# EAGLE design brick_i2c_LSM303DLH (EAGLE 7.2.0)
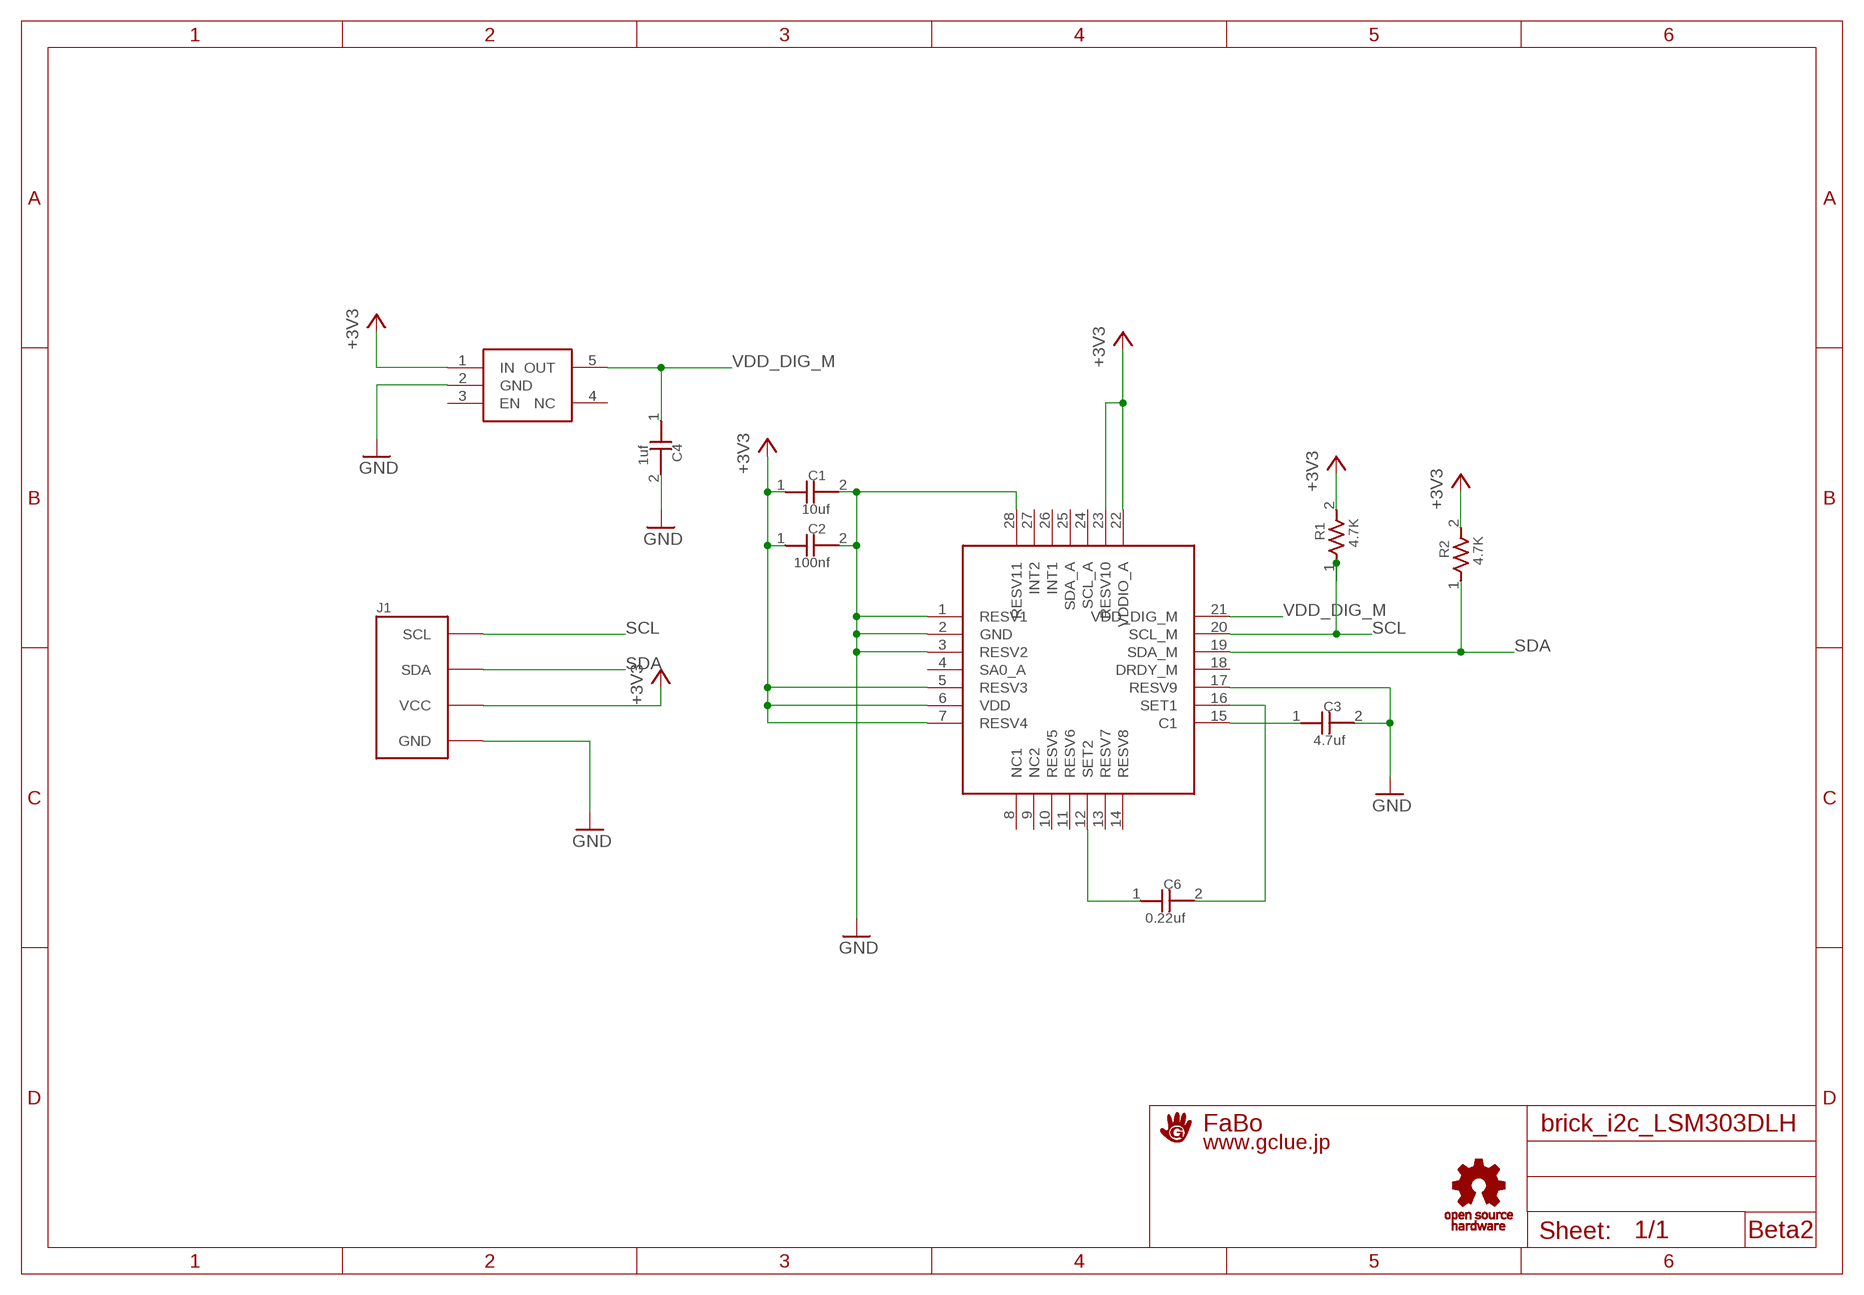
[diagram p0: schematic, sheet 1]

## Parts
C1  10uf  CAPACITOR0603  [0603]
C2  100nf  CAPACITOR0603  [0603]
C3  4.7uf  CAPACITOR0603  [0603]
C4  1uf  CAPACITOR0603  [0603]
C6  0.22uf  CAPACITOR0603  [0603]
J1  BRICK_I2C  [BRICK_I2C]
R1  4.7K  RESISTOR0603  [0603]
R2  4.7K  RESISTOR0603  [0603]
U$1  A4L-LOC-FABO_M  [LOGO_FABO_M]
U$2  ST-LSM303DLH  [LGA-28]
U$3  TI-TLV70018DDCT  [SOT23-5]
U$4  LOGO_OSHW_T-M  [LOGO_OSHW_T_M]

## Nets
+3V3: C1.1 C2.1 J1.VCC R1.2 R2.2 U$2.5(RESV3) U$2.6(VDD) U$2.7(RESV4) U$2.22(VDDIO_A) U$2.23(RESV10) U$3.1(IN)
GND: C1.2 C2.2 C3.2 C4.2 J1.GND U$2.1(RESV1) U$2.2(GND) U$2.3(RESV2) U$2.17(RESV9) U$2.28(RESV11) U$3.2(GND)
N$1: C6.1 U$2.12(SET2)
N$2: C6.2 U$2.16(SET1)
N$3: C3.1 U$2.15(C1)
SCL: J1.SCL R1.1 U$2.20(SCL_M)
SDA: J1.SDA R2.1 U$2.19(SDA_M)
VDD_DIG_M: C4.1 U$2.21(VDD_DIG_M) U$3.5(OUT)
Unconnected: U$2.4(SA0_A) U$2.8(NC1) U$2.9(NC2) U$2.10(RESV5) U$2.11(RESV6) U$2.13(RESV7) U$2.14(RESV8) U$2.18(DRDY_M) U$2.24(SCL_A) U$2.25(SDA_A) U$2.26(INT1) U$2.27(INT2) U$3.3(EN) U$3.4(NC)

## Notes on the sheet
- Beta2

## Library data of the parts
C1-C4 C6 = GClue-Capacitor:CAPACITOR
J1 = gclue:BRICK_I2C: FaBo Brick 4pin(I2C)
R1 R2 = GClue-Resistors:RESISTOR
U$1 = gclue:A4L-LOC: FaBo A4 FRAME
U$2 = GClue-Mems:ST-LSM303DLH
U$3 = gclueParts:TI-TLV70018DDCT
U$4 = gclue:LOGO_OSHW_T

## Board
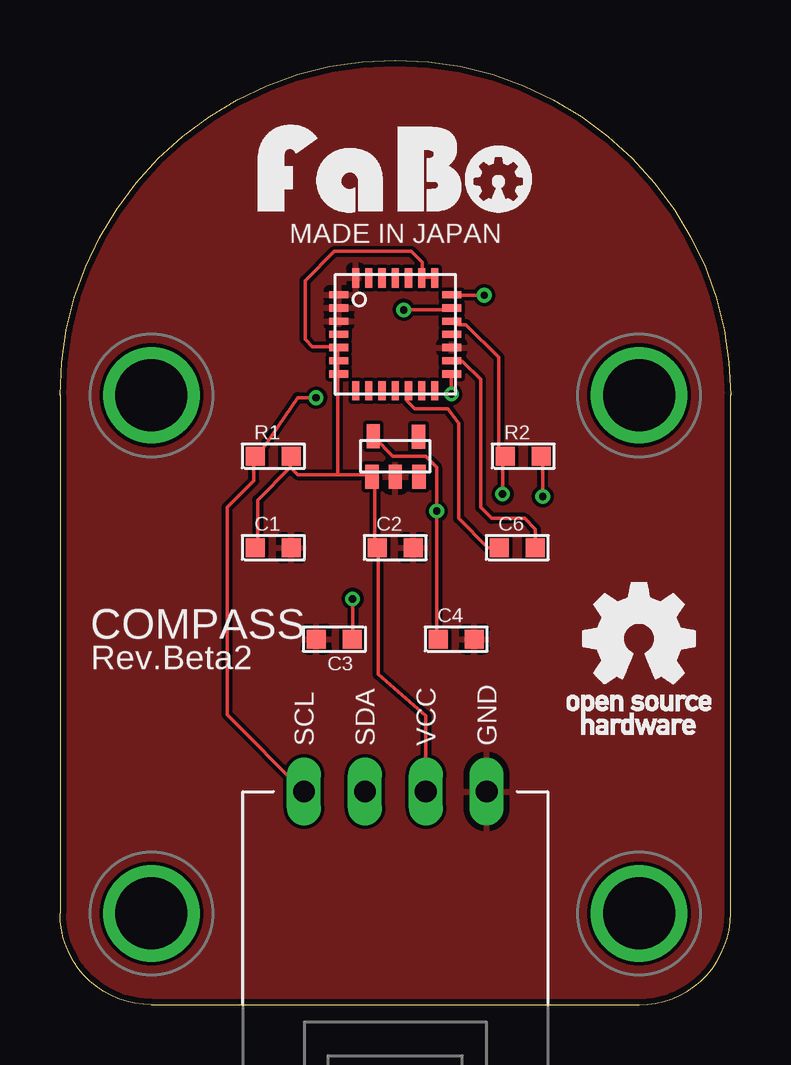
[diagram p1: board, top side]
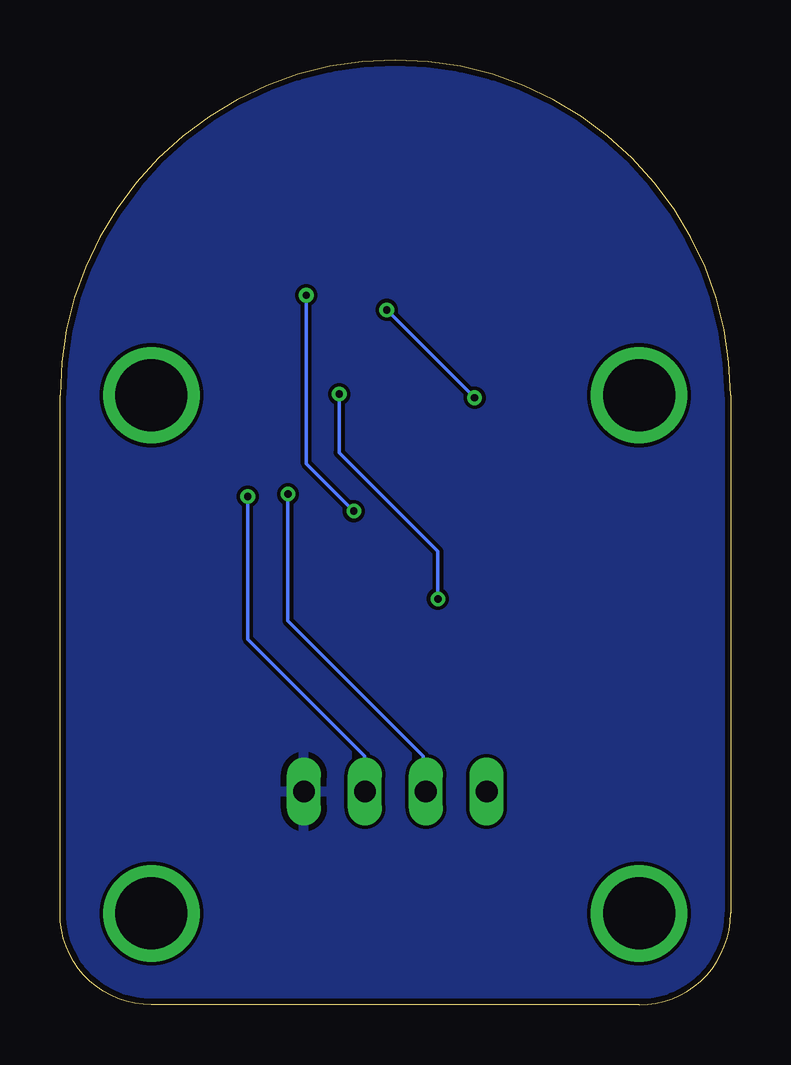
[diagram p2: board, bottom side, seen from below]

Size 27.94 x 39.37 mm. Coordinates in mm from the lower left corner, seen from the top.
Copper layers (1*16): Top 0.035mm / dielectric 1.5mm / Bottom 0.035mm
Design rules "Elecrow_2-layer_eagle_rule": minimum track width 6mil, minimum drill 12mil, track to track 6mil, track to pad 6mil, pad to pad 6mil, via to via 6mil, smd to smd 0mil, copper to edge 10mil, drill to drill 10mil, minimum pad ring 10mil, minimum via ring 6mil, stop-mask expansion 2mil, vias tented up to drill 100mil, thermal gap 10mil

### Footprints (pad centres in the part's own frame; a part is rotated, then mirrored left to right if it is on the bottom)
0603 = smd 0.8 x 0.8: 1 -0.75,0; 2 0.75,0
BRICK_I2C = drill 0.9 long: GND 3.81,-10.16; SCL -3.81,-10.16; SDA -1.27,-10.16; VCC 1.27,-10.16 | drill 3 pad 3.81: P$1 -10.16,6.35; P$2 10.16,6.35; P$3 -10.16,-15.24; P$4 10.16,-15.24
LGA-28 = smd 0.8 x 0.3: 1 -2.35,1.65; 2 -2.35,1.1; 3 -2.35,0.55; 4 -2.35,0; 5 -2.35,-0.55; 6 -2.35,-1.1; 7 -2.35,-1.65; 15 2.35,-1.65; 16 2.35,-1.1; 17 2.35,-0.55; 18 2.35,0; 19 2.35,0.55; 20 2.35,1.1; 21 2.35,1.65 | smd 0.3 x 0.8: 8 -1.65,-2.35; 9 -1.1,-2.35; 10 -0.55,-2.35; 11 0,-2.35; 12 0.55,-2.35; 13 1.1,-2.35; 14 1.65,-2.35; 22 1.65,2.35; 23 1.1,2.35; 24 0.55,2.35; 25 0,2.35; 26 -0.55,2.35; 27 -1.1,2.35; 28 -1.65,2.35
SOT23-5 = smd 0.55 x 1: 1 -0.97,-0.85; 2 0,-0.85; 3 0.99,-0.85; 4 0.97,0.82; 5 -0.92,0.84

### Placement (x,y rotation side)
C1  8.89,19.05 0 top
C2  13.97,19.05 0 top
C3  11.43,15.24 180 top
C4  16.51,15.24 0 top
C6  19.05,19.05 0 top
J1  13.97,19.05 0 top
R1  8.89,22.86 0 top
R2  19.3,22.86 0 top
U$2  13.97,27.94 0 top
U$3  13.97,22.86 0 top
U$4  24.13,15.24 0 top
U$5  [LOGO_FABO_M]  13.97,33.02 0 top

### Tracks (layer width: path | path; a pad name or v marks a point on that pad's centre or on a via)
+3V3  (via drill 0.3)
  Top 0.152: 15.09,30.33 15.54,30.33 U$2.22 | 15.09,30.33 15.09,30.94 14.63,31.39 11.43,31.39 10.21,30.18 10.21,27.74 10.52,27.43 11.58,27.43 U$2.5 11.58,27.28 11.58,26.98 U$2.6 11.58,26.82 11.58,26.36 U$2.7 11.58,26.21 11.58,22.1 | 15.09,30.33 U$2.23 | 9.6,22.4 8.23,21.03 8.23,19.05 C1.1 | 9.6,22.4 9.6,22.86 R1.2 | 11.58,22.1 9.91,22.1 9.6,22.4 | 11.58,22.1 12.95,22.1 U$3.1 13.11,21.95 13.11,19.05 C2.1 13.26,19.05 13.26,13.77 15.24,12.04 J1.VCC | v20.12,21.18 20.12,22.71 R2.2
  Bottom 0.152: v20.12,21.18 20.12,15.24 15.24,10.36 J1.VCC
GND
  pour Bottom: -1.27,-1.27 29.21,-1.27 29.21,40.64 -1.27,40.64
  pour Top: -1.27,-1.27 29.21,-1.27 29.21,40.64 -1.27,40.64
N$1
  Top 0.152: U$2.12 14.48,25.45 14.48,25.15 14.78,24.84 16.15,24.84 16.61,24.23 16.61,20.27 17.83,19.05 C6.1
N$2
  Top 0.152: U$2.16 16.46,26.82 16.76,26.82 17.53,26.06 17.53,20.73 17.98,20.27 19.36,20.27 19.81,19.81 19.81,19.2 C6.2
N$3  (via drill 0.3)
  Top 0.152: v12.19,16.92 12.19,15.24 C3.1 | v16.31,25.45 16.31,26.21 U$2.15
  Bottom 0.152: v16.31,25.45 16.31,23.01 12.19,18.9 v12.19,16.92
SCL  (via drill 0.3)
  Top 0.152: J1.SCL 6.96,12.09 6.96,20.73 8.08,21.84 8.08,22.86 R1.1 8.23,22.86 9.91,25.3 v10.67,25.3 | v14.33,28.96 16.31,28.96 U$2.20
  Bottom 0.152: v10.67,25.3 v14.33,28.96
SDA  (via drill 0.3)
  Top 0.152: U$2.19 16.46,28.35 16.92,28.35 18.29,26.98 18.29,22.86 R2.1 18.44,22.86 v18.44,21.29
  Bottom 0.152: v18.44,21.29 18.44,16 12.8,10.36 12.8,8.99 J1.SDA
VDD_DIG_M  (via drill 0.3)
  Top 0.152: C4.1 15.7,15.24 v15.7,20.57 15.7,22.4 15.24,22.86 13.87,22.86 13.11,23.62 U$3.5 | v17.68,29.57 16.46,29.57 U$2.21
  Bottom 0.152: v17.68,29.57 17.68,22.55 v15.7,20.57

### Text on the board
tPlace: MADE IN JAPAN | COMPASS | Rev.Beta2